# Altium project compactModalAccelPCB_V1.0.PrjPcb
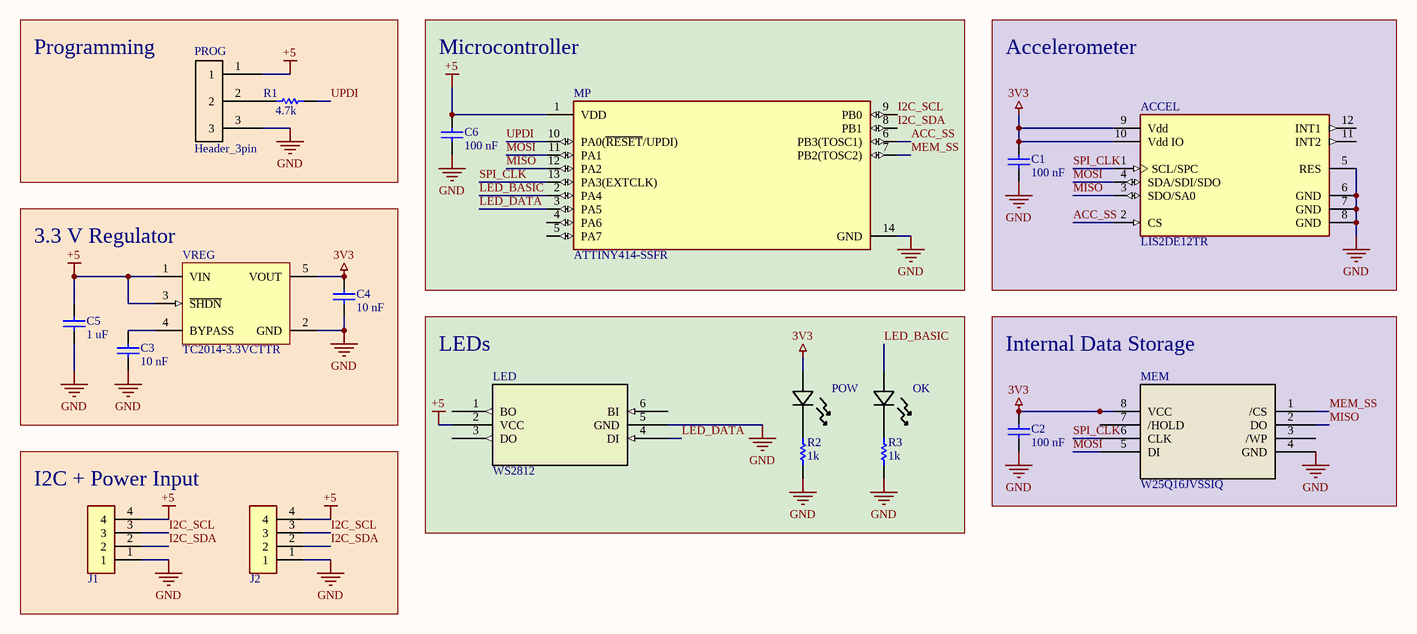
[diagram p0: compactModalAccel.SchDoc]
1 sheet, 19 parts. Net scope: global (net labels, ports and power ports of the same name join across sheets).
Board file: compactModalAccel.PcbDoc

## Sheet compactModalAccel.SchDoc
size B; SheetNumber: 1; SheetTotal: 1

### Parts
ACCEL  LIS2DE12TR  [FP-LGA-12-8365767-MFG]
C1  100 nF  [CAPC1608X95X40ML15T15]
C2  100 nF  [CAPC1608X95X40ML15T15]
C3  10 nF  [CAPC1608X95X40ML15T15]
C4  10 nF  [CAPC1608X95X40ML15T15]
C5  1 uF  [CAPC1608X95X40ML15T15]
C6  100 nF  [CAPC1608X95X40ML15T15]
J1  B4B-XH-A(LF)(SN)  [JST_B4B-XH-A(LF)(SN)]  (value not drawn)
J2  B4B-XH-A(LF)(SN)  [JST_B4B-XH-A(LF)(SN)]  (value not drawn)
LED  WS2812  [WS2812_WDS]
MEM  W25Q16JVSSIQ  [W25Q16JVSSIQ_WIN]
MP  ATTINY414-SSFR  [FP-C04-065-SL-IPC_A]
OK  HSMH-C170  [LED_HSMx-C170_AVA]  (value not drawn)
POW  HSMH-C170  [LED_HSMx-C170_AVA]  (value not drawn)
PROG  Header_3pin  [3pinHeader]
R1  4.7k  [RESC1609X50X30NL10T20]
R2  1k  [RESC1609X50X30NL10T20]
R3  1k  [RESC1609X50X30NL10T20]
VREG  TC2014-3.3VCTTR  [SOT-23-CT5_M]

### Blocks framed on the sheet
Programming: PROG R1
Microcontroller: C6 MP
Accelerometer: ACCEL C1
3.3 V Regulator: C3-C5 VREG
LEDs: LED OK POW R2 R3
Internal Data Storage: C2 MEM
I2C + Power Input: J1 J2

### Nets
3V3: ACCEL.9(Vdd) ACCEL.10(Vdd_IO) C1.1 C2.1 C4.1 MEM.8(VCC) POW.2 VREG.5(VOUT)
+5: C5.1 C6.1 J1.4 J2.4 LED.2(VCC) MP.1(VDD) PROG.1 VREG.1(VIN) VREG.3(~{SHDN})
GND: ACCEL.5(RES) ACCEL.6(GND) ACCEL.7(GND) ACCEL.8(GND) C1.2 C2.2 C3.2 C4.2 C5.2 C6.2 J1.1 J2.1 LED.5(GND) MEM.4(GND) MP.14(GND) PROG.3 R2.2 R3.2 VREG.2(GND)
ACC_SS: ACCEL.2(CS) MP.6(PB3(TOSC1))
I2C_SCL: J1.3 J2.3 MP.9(PB0)
I2C_SDA: J1.2 J2.2 MP.8(PB1)
LED_BASIC: MP.2(PA4) OK.2
LED_DATA: LED.4(DI) MP.3(PA5)
MEM_SS: MEM.1(/CS) MP.7(PB2(TOSC2))
MISO: ACCEL.3(SDO/SA0) MEM.2(DO) MP.12(PA2)
MOSI: ACCEL.4(SDA/SDI/SDO) MEM.5(DI) MP.11(PA1)
SPI_CLK: ACCEL.1(SCL/SPC) MEM.6(CLK) MP.13(PA3(EXTCLK))
UPDI: MP.10(PA0(~{RESET}/UPDI)) R1.2
NetC3_1: C3.1 VREG.4(BYPASS)
NetOK_1: OK.1 R3.1
NetPOW_1: POW.1 R2.1
NetPROG_2: PROG.2 R1.1

Not connected (* = marked no-connect by the designer): ACCEL 11(INT2) 12(INT1); LED 1(BO) 3(DO) 6(BI); MEM 3(/WP) 7(/HOLD); MP 4(PA6) 5(PA7)

### Library data of the parts
ACCEL = CMP-12175-000009-1: ACCEL 2-16G I2C/SPI 12LGA; Axis: X, Y, Z; Bandwidth: 0.5Hz; Max Supply Voltage: 3.6V; Output Type: SPI; Min Supply Voltage: 1.7V; Packaging: Cut Tape; Mount: Surface Mount; Min Operating Temperature: -40°C; Contact Plating: Gold; Max Operating Temperature: 85°C; Lead Free: Lead Free; Case/Package: LGA; Number of Pins: 12; REACH SVHC: No SVHC
C1-C6 = CMP-2006-01550-1: Manufacturer: Vitramon; Part Number: VJ0603Y104KXQCW1BC
J1 J2 = CMP-003-000002-1: Connector Header Through Hole 4 position 0.098 (2.50mm); MF: JST Sales; Availability: Warning; Check_prices: https://www.snapeda.com/parts/B4B-XH-A(LF)(SN)/JST%20Sales%20America%20Inc./view-part/447494/?ref=eda; Package: None; Price: None; Source: MainEnclosure.SchLib; Design Item ID: B4B-XH-A(LF)(SN); Value: *; SnapEDA_Link: https://www.snapeda.com/parts/B4B-XH-A(LF)(SN)/JST%20Sales%20America%20Inc./view-part/447494/?ref=snap; Purchase-URL: https://pricing.snapeda.com/search/part/B4B-XH-A(LF)(SN)/?ref=eda; MP: B4B-XH-A(LF)(SN)
LED = CMP-024-000000-2: Addressable LED; Mfr_Name: Worldsemi; Type: DEV; Copyright: Copyright (C) 2023 Ultra Librarian. All rights reserved.; RefDes: RefDes; Source: WS2812.SchLib; Manufacturer_Part_Number: WS2812; Design Item ID: WS2812
MEM = CMP-021-000000-1: No Description Available; Mfr_Name: Winbond; Source: W25Q16JVSSIQ.SchLib; RefDes: RefDes; Design Item ID: W25Q16JVSSIQ; Manufacturer_Part_Number: W25Q16JVSSIQ; Type: DEV; Copyright: Copyright (C) 2023 Ultra Librarian. All rights reserved.
MP = CMP-06276-000499-1: IC MCU 8BIT 4KB FLASH 14SOIC; Oscillator Type: Internal; Number of I/Os: 12; Core Architecture: AVR; Frequency: 20MHz; Peripherals: Brown-out Detect/Reset; Interface: I2C; Case/Package: SOIC; Mount: Surface Mount; Memory Type: FLASH; Packaging: Cut Tape; Min Operating Temperature: -40°C; Memory Size: 4KB; Number of Pins: 14; Max Operating Temperature: 125°C; Series: tinyAVR™ 1
OK POW = CMP-005-000006-1: No Description Available; Mfr_Name: Avago Technologies; Copyright: Copyright (C) 2023 Ultra Librarian. All rights reserved.; Manufacturer_Part_Number: HSMH-C170; RefDes: RefDes; Type: DEV; Source: HSMH-C170.SchLib; Design Item ID: HSMH-C170
PROG = CMP-003-000000-1: Design Item ID: Header_3pin; Source: MainEnclosure.SchLib
R1-R3 = CMP-2000-03412-1: Manufacturer: Vishay Dale; Part Number: CRCW06034K70FKTA
VREG = CMP-0136-00651-1: 50 mA, 100 mA, 150 mA CMOS LDOs with Shutdown and Reference Bypass, 5-Pin SOT-23, Extended Temperature, Tape and Reel; PackageReference: SOT-23-CT5; Code_IPC: SOT23-5; PackageVersion: revBB, Aug-2009; DatasheetVersion: revE, May-2006; PackageDescription: 5-Lead Plastic Small Outline Transistor (CT) [SOT-23]